# EAGLE design hackaday.com-ir-receiver-v1.4a (EAGLE 6.2)
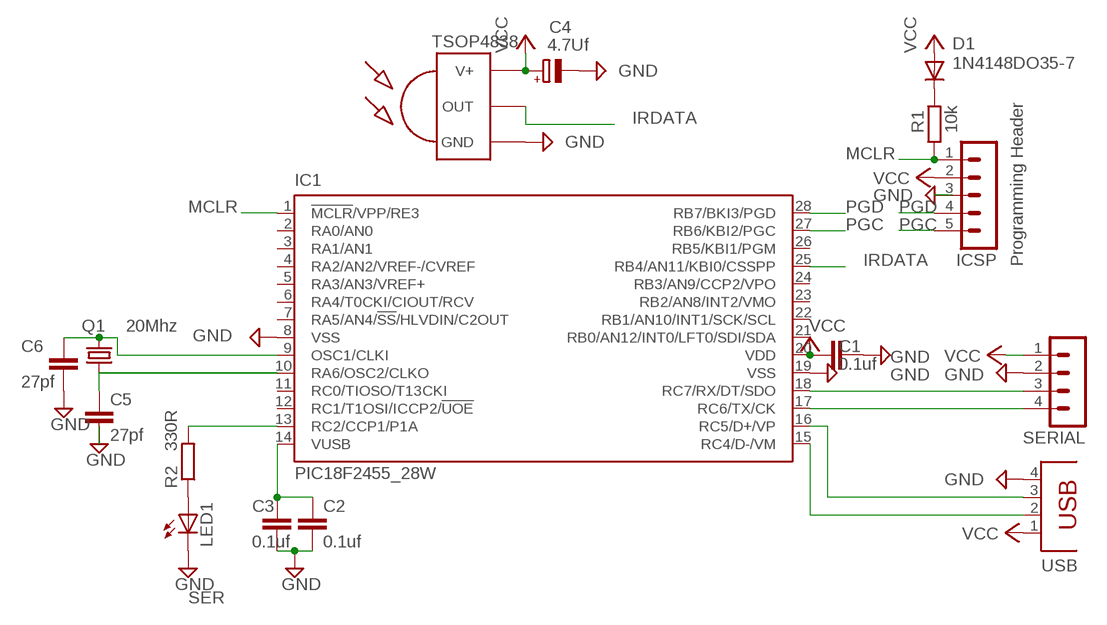
[diagram p0: schematic, sheet 1]

## Parts
C1  0.1uf  C-EU025-024X044  [C025-024X044]
C2  0.1uf  C-EU025-024X044  [C025-024X044]
C3  0.1uf  C-EU025-024X044  [C025-024X044]
C4  4.7Uf  CPOL-EUE2.5-5  [E2,5-5]
C5  27pf  C-EU025-024X044  [C025-024X044]
C6  27pf  C-EU025-024X044  [C025-024X044]
D1  1N4148DO35-7  [DO35-7]
IC1  PIC18F2455_28W  [SO28W]
ICSP  MA05-1  [MA05-1]
LED1  LED3MM  [LED3MM]
Q1  20Mhz  CRYSTALHC49U-V  [HC49U-V]
R1  10k  R-EU_0204/2V  [0204V]
R2  330R  R-EU_0204/2V  [0204V]
SERIAL  MA04-1  [MA04-1]
TSOP-1738  TSOP4838  [TSOP18XX]
USB  PN61729  [PN61729]

## Nets
CLKI: C6.1 IC1.9(OSC1/CLKI) Q1.2
CLKO: C5.1 IC1.10(RA6/OSC2/CLKO) Q1.1
GND: C1.2 C2.2 C3.2 C4.- C5.2 C6.2 IC1.8(VSS) IC1.19(VSS) ICSP.3 LED1.K(C) SERIAL.2 TSOP-1738.GND USB.4
IRDATA: IC1.25(RB4/AN11/KBI0/CSSPP) TSOP-1738.OUT
MCLR: IC1.1(!MCLR!/VPP/RE3) ICSP.1 R1.1
N$3: C2.1 C3.1 IC1.14(VUSB)
N$4: IC1.17(RC6/TX/CK) SERIAL.4
N$5: IC1.18(RC7/RX/DT/SDO) SERIAL.3
N$7: LED1.A R2.1
N$17: D1.C R1.2
N$27: IC1.13(RC2/CCP1/P1A) R2.2
PGC: IC1.27(RB6/KBI2/PGC) ICSP.5
PGD: IC1.28(RB7/BKI3/PGD) ICSP.4
RC4: IC1.15(RC4/D-/VM) USB.2
RC5: IC1.16(RC5/D+/VP) USB.3
VCC: C1.1 C4.+ D1.A IC1.20(VDD) ICSP.2 SERIAL.1 TSOP-1738.VCC(V+) USB.1
Unconnected: IC1.2(RA0/AN0) IC1.3(RA1/AN1) IC1.4(RA2/AN2/VREF-/CVREF) IC1.5(RA3/AN3/VREF+) IC1.6(RA4/T0CKI/CIOUT/RCV) IC1.7(RA5/AN4/!SS!/HLVDIN/C2OUT) IC1.11(RC0/TIOSO/T13CKI) IC1.12(RC1/T1OSI/ICCP2/!UOE) IC1.21(RB0/AN12/INT0/LFT0/SDI/SDA) IC1.22(RB1/AN10/INT1/SCK/SCL) IC1.23(RB2/AN8/INT2/VMO) IC1.24(RB3/AN9/CCP2/VPO) IC1.26(RB5/KBI1/PGM)

## Notes on the sheet
- Programming Header
- SER

## Library data of the parts
C1-C3 C5 C6 = duplicate-rcl:C-EU: CAPACITOR, European symbol
C4 = duplicate-rcl:CPOL-EU: POLARIZED CAPACITOR, European symbol
D1 = diode:1N4148: DIODE high speed (Philips)
IC1 = Duplicate:PIC18F2*_28: USB Microcontrollers with nanoWatt Technology High-Performance, Enhanced Flash, 28/40/44-Pin, Source: http://ww1.microchip.com/downloads/en/devicedoc/39632c.pdf; MF: MICROCHIP; MPN: PIC18F2455-I/SO; OC_FARNELL: 1579598; OC_NEWARK: 64J3768
ICSP = con-lstb:MA05-1: PIN HEADER; OC_FARNELL: unknown; OC_NEWARK: unknown
LED1 = duplicate-led:LED: LED OSRAM: - CHIPLED LG R971, LG N971, LY N971, LG Q971, LY Q971, LO R971, LY R971 LH N974, LH R974 LS Q976, LO Q976, LY Q976 LO Q996 - Hyper CHIPLED LW Q18S LB Q993, LB Q99A, LB R99A - SideLED LS A670, LO A670, LY A670, LG A670, LP A670 LB A673, LV A673, LT A673, LW A673 LH A674 LY A675 LS A676, LA A676, LO A676, LY A676, LW A676 LS A679, LY A679, LG A679 - Hyper Micro SIDELED® LS Y876, LA Y876, LO Y876, LY Y876 LT Y87S - SmartLED LW L88C, LW L88S LB L89C, LB L89S, LG L890 LS L89K, LO L89K, LY L89K LS L896, LA L896, LO L896, LY L896 - TOPLED LS T670, LO T670, LY T670, LG T670, LP T670 LSG T670, LSP T670, LSY T670, LOP T670, LYG T670 LG T671, LOG T671, LSG T671 LB T673, LV T673, LT T673, LW T673 LH T674 LS T676, LA T676, LO T676, LY T676, LB T676, LH T676, LSB T676, LW T676 LB T67C, LV T67C, LT T67C, LS T67K, LO T67K, LY T67K, LW E67C LS E67B, LA E67B, LO E67B, LY E67B, LB E67C, LV E67C, LT E67C LW T67C LS T679, LY T679, LG T679 LS T770, LO T770, LY T770, LG T770, LP T770 LB T773, LV T773, LT T773, LW T773 LH T774 LS E675, LA E675, LY E675, LS T675 LS T776, LA T776, LO T776, LY T776, LB T776 LHGB T686 LT T68C, LB T68C - Hyper Mini TOPLED® LB M676 - Mini TOPLED Santana® LG M470 LS M47K, LO M47K, LY M47K Source: http://www.osram.convergy.de LUXEON: - LUMILED® LXK2-PW12-R00, LXK2-PW12-S00, LXK2-PW14-U00, LXK2-PW14-V00 LXK2-PM12-R00, LXK2-PM12-S00, LXK2-PM14-U00 LXK2-PE12-Q00, LXK2-PE12-R00, LXK2-PE12-S00, LXK2-PE14-T00, LXK2-PE14-U00 LXK2-PB12-K00, LXK2-PB12-L00, LXK2-PB12-M00, LXK2-PB14-N00, LXK2-PB14-P00, LXK2-PB14-Q00 LXK2-PR12-L00, LXK2-PR12-M00, LXK2-PR14-Q00, LXK2-PR14-R00 LXK2-PD12-Q00, LXK2-PD12-R00, LXK2-PD12-S00 LXK2-PH12-R00, LXK2-PH12-S00 LXK2-PL12-P00, LXK2-PL12-Q00, LXK2-PL12-R00 Source: www.luxeon.com KINGBRIGHT: KA-3528ASYC Source: www.kingbright.com
Q1 = duplicate-crystal:CRYSTAL: CRYSTAL; OC_FARNELL: 1666969; OC_NEWARK: unknown
R1 R2 = duplicate-rcl:R-EU_: RESISTOR, European symbol
SERIAL = con-lstb:MA04-1: PIN HEADER; OC_FARNELL: unknown; OC_NEWARK: unknown
TSOP-1738 = tsop-1:TSOP4838: IR Receiver and Demodulator
USB = con-berg:PN61729: BERG USB connector; OC_FARNELL: unknown; OC_NEWARK: unknown

## Board
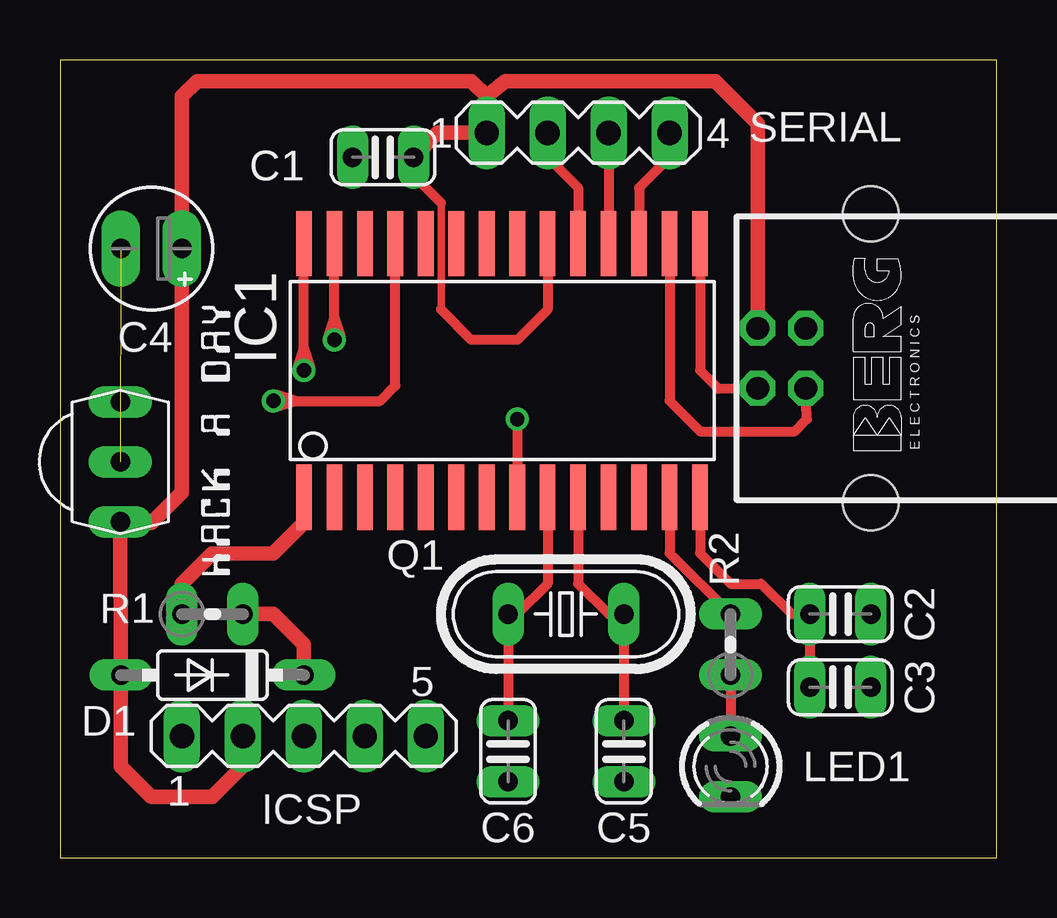
[diagram p1: board, top side]
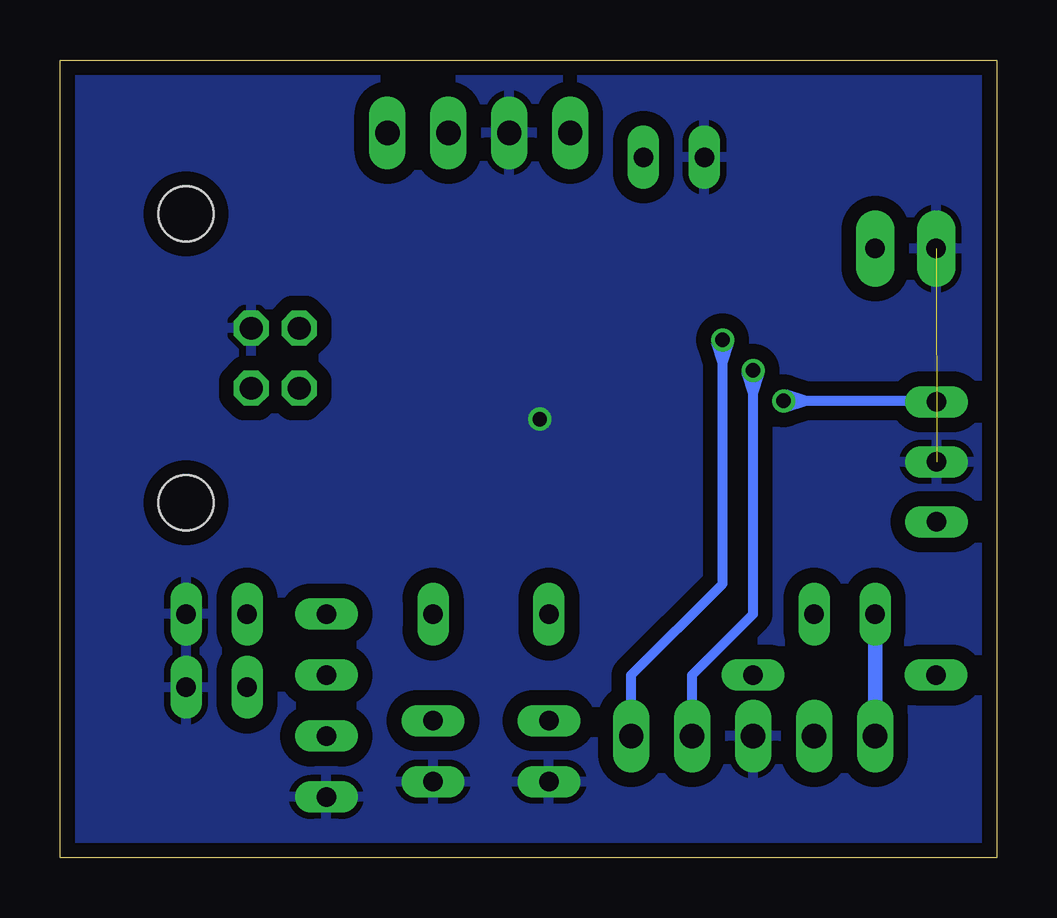
[diagram p2: board, bottom side, seen from below]

Size 39.04 x 33.26 mm. Coordinates in mm from the lower left corner, seen from the top.
Outline: 0,0 39.04,0 39.04,33.26 0,33.26 0,0
Copper layers (1*16): Top 0.0356mm / dielectric 1.5011mm / Bottom 0.0356mm
Design rules: minimum track width 6mil, minimum drill 13mil, track to track 6mil, track to pad 6mil, pad to pad 6mil, via to via 6mil, smd to smd 6mil, copper to edge 15mil, drill to drill 6mil, minimum pad ring 10mil, minimum via ring 7mil, stop-mask expansion 4mil, vias tented up to drill 0mil, thermal gap 10mil

### Footprints (pad centres in the part's own frame; a part is rotated, then mirrored left to right if it is on the bottom)
C025-024X044 = drill 0.813 long: 1 -1.27,0; 2 1.27,0
E2,5-5 = drill 0.813 pad 1.6 long: + -1.27,0; - 1.27,0
DO35-7 = drill 0.813 long: A 3.81,0; C -3.81,0
SO28W = smd 0.65 x 2.716: 1 -7.62,-5.288; 2 -6.35,-5.288; 3 -5.08,-5.288; 4 -3.81,-5.288; 5 -2.54,-5.288; 6 -1.27,-5.288; 7 0,-5.288; 8 1.27,-5.288; 9 2.54,-5.288; 10 3.81,-5.288; 11 5.08,-5.288; 12 6.35,-5.288; 13 7.62,-5.288; 14 8.89,-5.288; 15 8.89,5.288; 16 7.62,5.288; 17 6.35,5.288; 18 5.08,5.288; 19 3.81,5.288; 20 2.54,5.288; 21 1.27,5.288; 22 0,5.288; 23 -1.27,5.288; 24 -2.54,5.288; 25 -3.81,5.288; 26 -5.08,5.288; 27 -6.35,5.288; 28 -7.62,5.288
MA05-1 = drill 1.016 long: 1 -5.08,0; 2 -2.54,0; 3 0,0; 4 2.54,0; 5 5.08,0
LED3MM = drill 0.813 long: A -1.27,0; K 1.27,0
HC49U-V = drill 0.813 long: 1 -2.413,0; 2 2.413,0
0204V = drill 0.813 long: 1 -1.27,0; 2 1.27,0
MA04-1 = drill 1.016 long: 1 -3.81,0; 2 -1.27,0; 3 1.27,0; 4 3.81,0
TSOP18XX = drill 0.813 long: GND -0.001,-0.027; OUT -2.501,-0.027; VCC 2.499,-0.027
PN61729 = drill 0.95 octagon: 1 1.25,4.71; 2 -1.25,4.71; 3 -1.25,2.71; 4 1.25,2.71 | hole 2.3: -6.02,0; 6.02,0

### Placement (x,y rotation side)
C1  13.46,29.21 180 top
C2  32.51,10.16 0 top
C3  32.51,7.11 0 top
C4  3.81,25.4 180 top
C5  23.5,4.45 270 top
C6  18.67,4.45 270 top
D1  6.35,7.62 180 top
IC1  17.78,20.32 0 top
ICSP  10.16,5.08 0 top
LED1  27.94,3.81 270 top
Q1  21.08,10.16 180 top
R1  6.35,10.16 0 top
R2  27.94,8.89 90 top
SERIAL  21.59,30.23 0 top
TSOP-1738  2.54,16.51 270 top
U$1  [HACKADAY-TEXT-ONLY]  7.62,11.43 90 top
USB  33.78,20.83 90 top

### Tracks (layer width: path | path; a pad name or v marks a point on that pad's centre or on a via)
CLKI
  Top 0.406: C6.1 Q1.2 19.05,10.16 20.32,11.43 IC1.9
CLKO
  Top 0.406: C5.1 Q1.1 22.86,10.16 21.59,11.43 IC1.10
GND  (via drill 0.6)  (1 unrouted)
  Top 0.406: SERIAL.2 20.32,29.21 21.59,27.94 IC1.19 | v19.05,18.29 IC1.8
  pour Bottom (isolate 0.61): 40.64,35.05 40.64,-1.27 -1.27,-1.27 -1.27,35.05
IRDATA  (via drill 0.61)
  Top 0.254: 13.97,25.4 IC1.25
  Top 0.406: v8.89,19.05 9.8,19.05 | 9.8,19.05 | 9.8,19.05 13.34,19.05 13.97,19.68 IC1.25 | 9.8,19.05 8.97,19.32 | 9.8,19.05 8.97,19.32 | 8.97,19.32 | 8.97,19.32 | 9.8,19.05 8.97,18.78 | 8.97,18.78 | v8.89,19.05 8.97,18.78 | 8.97,19.32 | 8.97,18.78 | v8.89,19.05 8.97,18.78 | 9.8,19.05 8.97,19.32 | 8.97,19.32 | 9.8,19.05 8.97,19.32 | v8.89,19.05 8.97,19.32 | 9.8,19.05 | 9.8,19.05 8.97,18.78 | 8.97,18.78 | 9.8,19.05 8.97,19.32 | v8.89,19.05 8.97,19.32 | 9.8,19.05 8.97,18.78 | v8.89,19.05 8.97,18.78 | 9.8,19.05 8.97,19.32 | v8.89,19.05 8.97,19.32 | 9.8,19.05 8.97,18.78 | v8.89,19.05 8.97,18.78
  Bottom 0.254: 2.54,19.05 TSOP-1738.OUT
  Bottom 0.406: 2.54,19.05 7.98,19.05 | 7.98,19.05 | 7.98,19.05 v8.89,19.05 | 7.98,19.05 8.8,19.32 | 8.8,18.78 | 8.8,18.78 | 7.98,19.05 8.8,18.78 | 8.8,18.78 | v8.89,19.05 8.8,18.78 | 7.98,19.05 8.8,19.32 | 8.8,19.32 | 8.8,19.32 | 7.98,19.05 8.8,19.32 | 7.98,19.05 8.8,18.78 | 8.8,18.78 | 7.98,19.05 | 7.98,19.05 8.8,18.78 | 8.8,18.78 | v8.89,19.05 8.8,18.78 | 7.98,19.05 8.8,19.32 | 8.8,19.32 | v8.89,19.05 8.8,19.32 | 7.98,19.05 8.8,18.78 | v8.89,19.05 8.8,18.78 | 7.98,19.05 8.8,19.32 | 8.8,19.32 | 7.98,19.05 8.8,18.78 | v8.89,19.05 8.8,18.78 | 7.98,19.05 8.8,19.32 | v8.89,19.05 8.8,19.32
MCLR
  Top 0.152: 10.16,13.97 IC1.1
  Top 0.61: 10.16,13.97 8.89,12.7 6.35,12.7 5.08,11.43 R1.1
  Bottom 0.61: R1.1 ICSP.1
N$3
  Top 0.406: IC1.14 26.67,12.7 27.94,11.43 29.21,11.43 30.48,10.16 C2.1 C3.1
N$4
  Top 0.406: SERIAL.4 25.4,29.21 24.13,27.94 IC1.17
N$5
  Top 0.406: SERIAL.3 IC1.18
N$7
  Top 0.406: R2.1 LED1.A
N$17
  Top 0.61: D1.C 10.16,8.89 8.89,10.16 R1.2
N$27
  Top 0.406: IC1.13 25.4,12.7 R2.2
PGC  (via drill 0.61)
  Top 0.254: 11.43,25.4 IC1.27
  Top 0.406: v11.43,21.59 11.43,22.5 | 11.43,22.5 | 11.43,22.5 IC1.27 | 11.43,22.5 11.7,21.68 | 11.16,21.68 | 11.16,21.68 | 11.43,22.5 11.16,21.68 | 11.16,21.68 | v11.43,21.59 11.16,21.68 | 11.43,22.5 11.7,21.68 | 11.7,21.68 | 11.7,21.68 | 11.43,22.5 11.7,21.68 | 11.43,22.5 11.16,21.68 | 11.16,21.68 | 11.43,22.5 | 11.43,22.5 11.16,21.68 | 11.16,21.68 | v11.43,21.59 11.16,21.68 | 11.43,22.5 11.7,21.68 | 11.7,21.68 | v11.43,21.59 11.7,21.68 | 11.43,22.5 11.16,21.68 | v11.43,21.59 11.16,21.68 | 11.43,22.5 11.7,21.68 | 11.7,21.68 | 11.43,22.5 11.16,21.68 | v11.43,21.59 11.16,21.68 | 11.43,22.5 11.7,21.68 | v11.43,21.59 11.7,21.68
  Bottom 0.406: 11.43,20.68 11.43,11.43 15.24,7.62 ICSP.5 | 11.43,20.68 | 11.43,20.68 v11.43,21.59 | 11.43,20.68 11.7,21.5 | 11.43,20.68 11.7,21.5 | 11.7,21.5 | 11.7,21.5 | 11.43,20.68 11.16,21.5 | 11.16,21.5 | v11.43,21.59 11.16,21.5 | 11.7,21.5 | 11.16,21.5 | v11.43,21.59 11.16,21.5 | 11.43,20.68 11.7,21.5 | 11.7,21.5 | 11.43,20.68 11.7,21.5 | v11.43,21.59 11.7,21.5 | 11.43,20.68 | 11.43,20.68 11.16,21.5 | 11.16,21.5 | 11.43,20.68 11.7,21.5 | v11.43,21.59 11.7,21.5 | 11.43,20.68 11.16,21.5 | v11.43,21.59 11.16,21.5 | 11.43,20.68 11.7,21.5 | v11.43,21.59 11.7,21.5 | 11.43,20.68 11.16,21.5 | v11.43,21.59 11.16,21.5
PGD  (via drill 0.61)
  Top 0.254: 10.16,25.4 IC1.28
  Top 0.406: v10.16,20.32 10.16,21.23 | 10.16,21.23 | 10.16,21.23 IC1.28 | 10.16,21.23 10.43,20.41 | 9.89,20.41 | 9.89,20.41 | 10.16,21.23 9.89,20.41 | 9.89,20.41 | v10.16,20.32 9.89,20.41 | 10.16,21.23 10.43,20.41 | 10.43,20.41 | 10.43,20.41 | 10.16,21.23 10.43,20.41 | 10.16,21.23 9.89,20.41 | 9.89,20.41 | 10.16,21.23 | 10.16,21.23 9.89,20.41 | 9.89,20.41 | v10.16,20.32 9.89,20.41 | 10.16,21.23 10.43,20.41 | 10.43,20.41 | v10.16,20.32 10.43,20.41 | 10.16,21.23 9.89,20.41 | v10.16,20.32 9.89,20.41 | 10.16,21.23 10.43,20.41 | 10.43,20.41 | 10.16,21.23 9.89,20.41 | v10.16,20.32 9.89,20.41 | 10.16,21.23 10.43,20.41 | v10.16,20.32 10.43,20.41
  Bottom 0.406: 10.16,19.41 10.16,10.16 12.7,7.62 ICSP.4 | 10.16,19.41 | 10.16,19.41 v10.16,20.32 | 10.16,19.41 10.43,20.23 | 10.16,19.41 10.43,20.23 | 10.43,20.23 | 10.43,20.23 | 10.16,19.41 9.89,20.23 | 9.89,20.23 | v10.16,20.32 9.89,20.23 | 10.43,20.23 | 9.89,20.23 | v10.16,20.32 9.89,20.23 | 10.16,19.41 10.43,20.23 | 10.43,20.23 | 10.16,19.41 10.43,20.23 | v10.16,20.32 10.43,20.23 | 10.16,19.41 | 10.16,19.41 9.89,20.23 | 9.89,20.23 | 10.16,19.41 10.43,20.23 | v10.16,20.32 10.43,20.23 | 10.16,19.41 9.89,20.23 | v10.16,20.32 9.89,20.23 | 10.16,19.41 10.43,20.23 | v10.16,20.32 10.43,20.23 | 10.16,19.41 9.89,20.23 | v10.16,20.32 9.89,20.23
RC4
  Top 0.406: IC1.15 26.67,20.32 27.43,19.56 USB.2
RC5
  Top 0.406: IC1.16 25.4,19.05 26.67,17.78 30.61,17.78 31.11,18.29 USB.3
VCC
  Top 0.305: 15.88,22.86 15.88,27.3
  Top 0.406: IC1.20 20.32,22.86 19.05,21.59 17.14,21.59 15.88,22.86 | 15.88,27.3 14.73,28.45
  Top 0.61: ICSP.2 7.62,3.81 6.35,2.54 3.81,2.54 2.54,3.81 D1.A TSOP-1738.VCC 3.81,13.97 5.08,15.24 C4.+ 5.08,31.75 5.71,32.38 17.14,32.38 17.78,31.75 | USB.1 29.08,30.61 27.3,32.38 18.54,32.38 17.78,31.75 | 17.78,31.75 SERIAL.1 15.75,30.23 C1.1 14.73,28.45